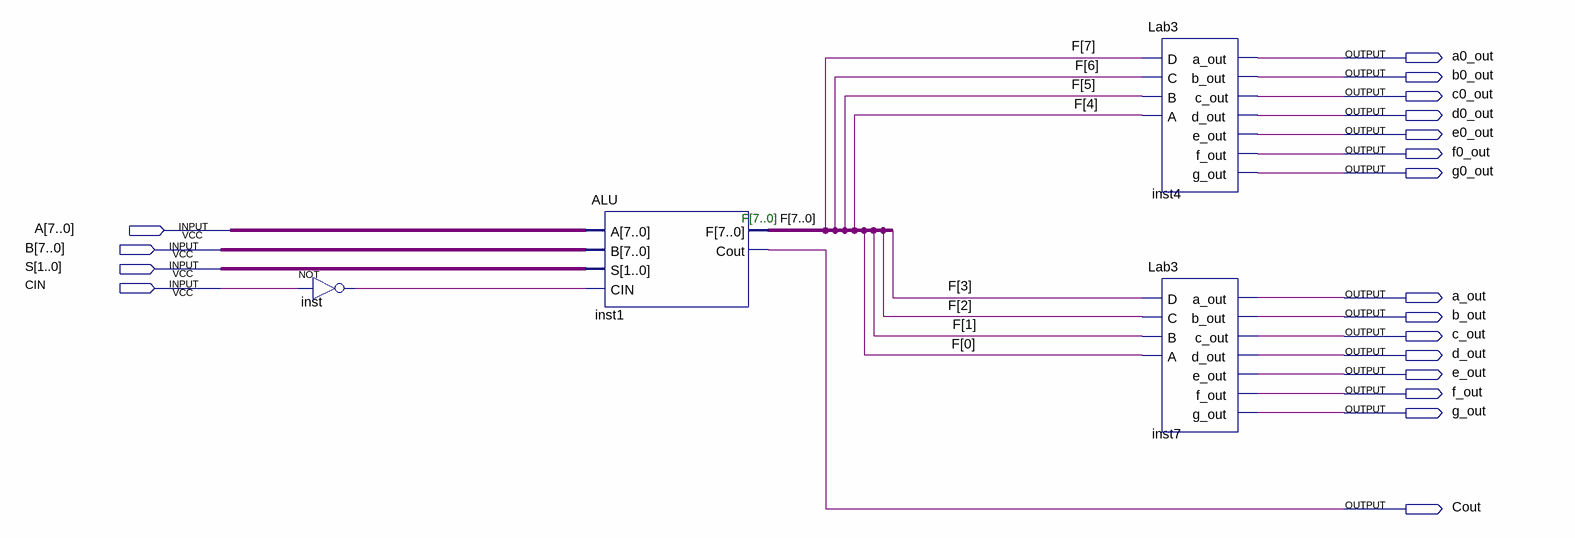
[diagram p0: schematic sheet]
// Quartus schematic Lab6.bdf as structural Verilog: 4 symbols, 19 pins
module Lab6 (
  input  [7:0] A,
  input  [7:0] B,
  input  [1:0] S,
  input  CIN,
  output a0_out,
  output b0_out,
  output c0_out,
  output d0_out,
  output e0_out,
  output f0_out,
  output g0_out,
  output a_out,
  output b_out,
  output c_out,
  output d_out,
  output e_out,
  output f_out,
  output g_out,
  output Cout
);

  wire inst_out;
  wire [7:0] F;

  not inst (inst_out, CIN);
  ALU inst1 (.A(A), .B(B), .S(S), .CIN(inst_out), .F(F), .Cout(Cout));
  Lab3 inst4 (
    .D(F[7]), .C(F[6]), .B(F[5]), .A(F[4]), .a_out(a0_out), .b_out(b0_out), .c_out(c0_out), .d_out(d0_out),
    .e_out(e0_out), .f_out(f0_out), .g_out(g0_out));
  Lab3 inst7 (
    .D(F[3]), .C(F[2]), .B(F[1]), .A(F[0]), .a_out(a_out), .b_out(b_out), .c_out(c_out), .d_out(d_out),
    .e_out(e_out), .f_out(f_out), .g_out(g_out));

  // Notes on the sheet:
  //   F[7..0]
endmodule
